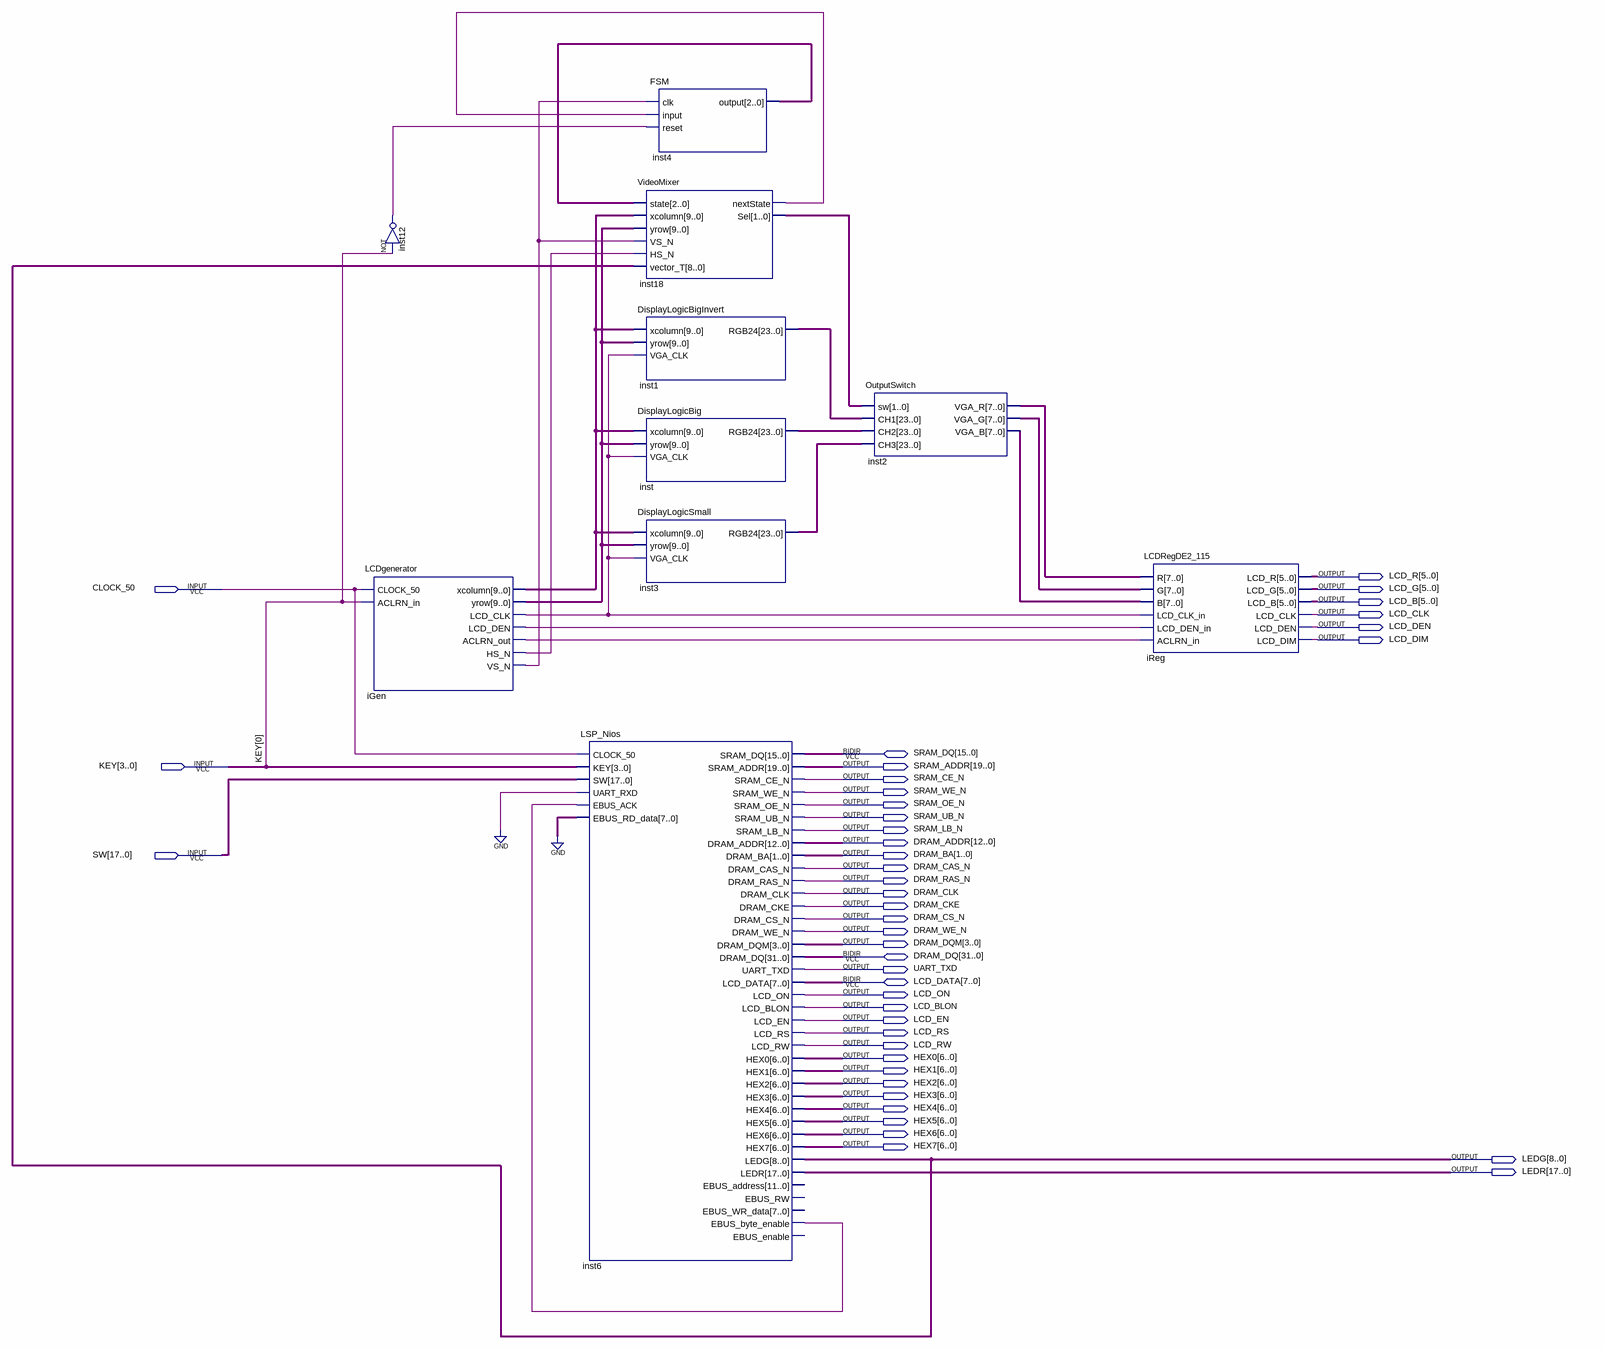
[diagram p0: schematic sheet]
// Quartus schematic Demo_LCD.bdf as structural Verilog: 10 symbols, 43 pins
module Demo_LCD (
  input  CLOCK_50,
  input  [3:0] KEY,
  input  [17:0] SW,
  inout  [15:0] SRAM_DQ,
  inout  [31:0] DRAM_DQ,
  inout  [7:0] LCD_DATA,
  output [5:0] LCD_R,
  output [5:0] LCD_G,
  output [5:0] LCD_B,
  output LCD_CLK,
  output LCD_DEN,
  output LCD_DIM,
  output [19:0] SRAM_ADDR,
  output SRAM_CE_N,
  output SRAM_WE_N,
  output SRAM_OE_N,
  output SRAM_UB_N,
  output SRAM_LB_N,
  output [12:0] DRAM_ADDR,
  output [1:0] DRAM_BA,
  output DRAM_CAS_N,
  output DRAM_RAS_N,
  output DRAM_CLK,
  output DRAM_CKE,
  output DRAM_CS_N,
  output DRAM_WE_N,
  output [3:0] DRAM_DQM,
  output UART_TXD,
  output LCD_ON,
  output LCD_BLON,
  output LCD_EN,
  output LCD_RS,
  output LCD_RW,
  output [6:0] HEX0,
  output [6:0] HEX1,
  output [6:0] HEX2,
  output [6:0] HEX3,
  output [6:0] HEX4,
  output [6:0] HEX5,
  output [6:0] HEX6,
  output [6:0] HEX7,
  output [8:0] LEDG,
  output [17:0] LEDR
);

  wire iGen_aclrn_out, iGen_hs_n, iGen_lcd_clk, iGen_lcd_den, iGen_vs_n, inst6_ebus_byte_enable, inst12_out,
       inst18_nextstate;
  wire [1:0] inst18_sel;
  wire [2:0] inst4_output;
  wire [7:0] inst2_vga_b, inst2_vga_g, inst2_vga_r;
  wire [9:0] iGen_xcolumn, iGen_yrow;
  wire [23:0] inst1_rgb24, inst3_rgb24, inst_rgb24;

  not inst12 (inst12_out, KEY[0]);
  LCDgenerator iGen (
    .CLOCK_50(CLOCK_50), .ACLRN_in(KEY[0]), .xcolumn(iGen_xcolumn), .yrow(iGen_yrow), .LCD_CLK(iGen_lcd_clk),
    .LCD_DEN(iGen_lcd_den), .ACLRN_out(iGen_aclrn_out), .HS_N(iGen_hs_n), .VS_N(iGen_vs_n));
  LSP_Nios inst6 (
    .CLOCK_50(CLOCK_50), .KEY(KEY), .SW(SW), .UART_RXD(1'b0), .EBUS_ACK(inst6_ebus_byte_enable),
    .EBUS_RD_data({8{1'b0}}), .SRAM_ADDR(SRAM_ADDR), .SRAM_CE_N(SRAM_CE_N), .SRAM_WE_N(SRAM_WE_N),
    .SRAM_OE_N(SRAM_OE_N), .SRAM_UB_N(SRAM_UB_N), .SRAM_LB_N(SRAM_LB_N), .DRAM_ADDR(DRAM_ADDR),
    .DRAM_BA(DRAM_BA), .DRAM_CAS_N(DRAM_CAS_N), .DRAM_RAS_N(DRAM_RAS_N), .DRAM_CLK(DRAM_CLK),
    .DRAM_CKE(DRAM_CKE), .DRAM_CS_N(DRAM_CS_N), .DRAM_WE_N(DRAM_WE_N), .DRAM_DQM(DRAM_DQM),
    .UART_TXD(UART_TXD), .LCD_ON(LCD_ON), .LCD_BLON(LCD_BLON), .LCD_EN(LCD_EN), .LCD_RS(LCD_RS),
    .LCD_RW(LCD_RW), .HEX0(HEX0), .HEX1(HEX1), .HEX2(HEX2), .HEX3(HEX3), .HEX4(HEX4), .HEX5(HEX5),
    .HEX6(HEX6), .HEX7(HEX7), .LEDG(LEDG), .LEDR(LEDR), .EBUS_byte_enable(inst6_ebus_byte_enable),
    .SRAM_DQ(SRAM_DQ), .DRAM_DQ(DRAM_DQ), .LCD_DATA(LCD_DATA));  // open: EBUS_address, EBUS_RW, EBUS_WR_data, EBUS_enable
  VideoMixer inst18 (
    .state(inst4_output), .xcolumn(iGen_xcolumn), .yrow(iGen_yrow), .VS_N(iGen_vs_n), .HS_N(iGen_hs_n),
    .vector_T(LEDG), .nextState(inst18_nextstate), .Sel(inst18_sel));
  DisplayLogicBigInvert inst1 (.xcolumn(iGen_xcolumn), .yrow(iGen_yrow), .VGA_CLK(iGen_lcd_clk), .RGB24(inst1_rgb24));
  DisplayLogicBig inst (.xcolumn(iGen_xcolumn), .yrow(iGen_yrow), .VGA_CLK(iGen_lcd_clk), .RGB24(inst_rgb24));
  DisplayLogicSmall inst3 (.xcolumn(iGen_xcolumn), .yrow(iGen_yrow), .VGA_CLK(iGen_lcd_clk), .RGB24(inst3_rgb24));
  FSM inst4 (.clk(iGen_vs_n), .\input (inst18_nextstate), .reset(inst12_out), .\output (inst4_output));
  OutputSwitch inst2 (
    .sw(inst18_sel), .CH1(inst1_rgb24), .CH2(inst_rgb24), .CH3(inst3_rgb24), .VGA_R(inst2_vga_r),
    .VGA_G(inst2_vga_g), .VGA_B(inst2_vga_b));
  LCDRegDE2_115 iReg (
    .R(inst2_vga_r), .G(inst2_vga_g), .B(inst2_vga_b), .LCD_CLK_in(iGen_lcd_clk), .LCD_DEN_in(iGen_lcd_den),
    .ACLRN_in(iGen_aclrn_out), .LCD_R(LCD_R), .LCD_G(LCD_G), .LCD_B(LCD_B), .LCD_CLK(LCD_CLK),
    .LCD_DEN(LCD_DEN), .LCD_DIM(LCD_DIM));
endmodule
